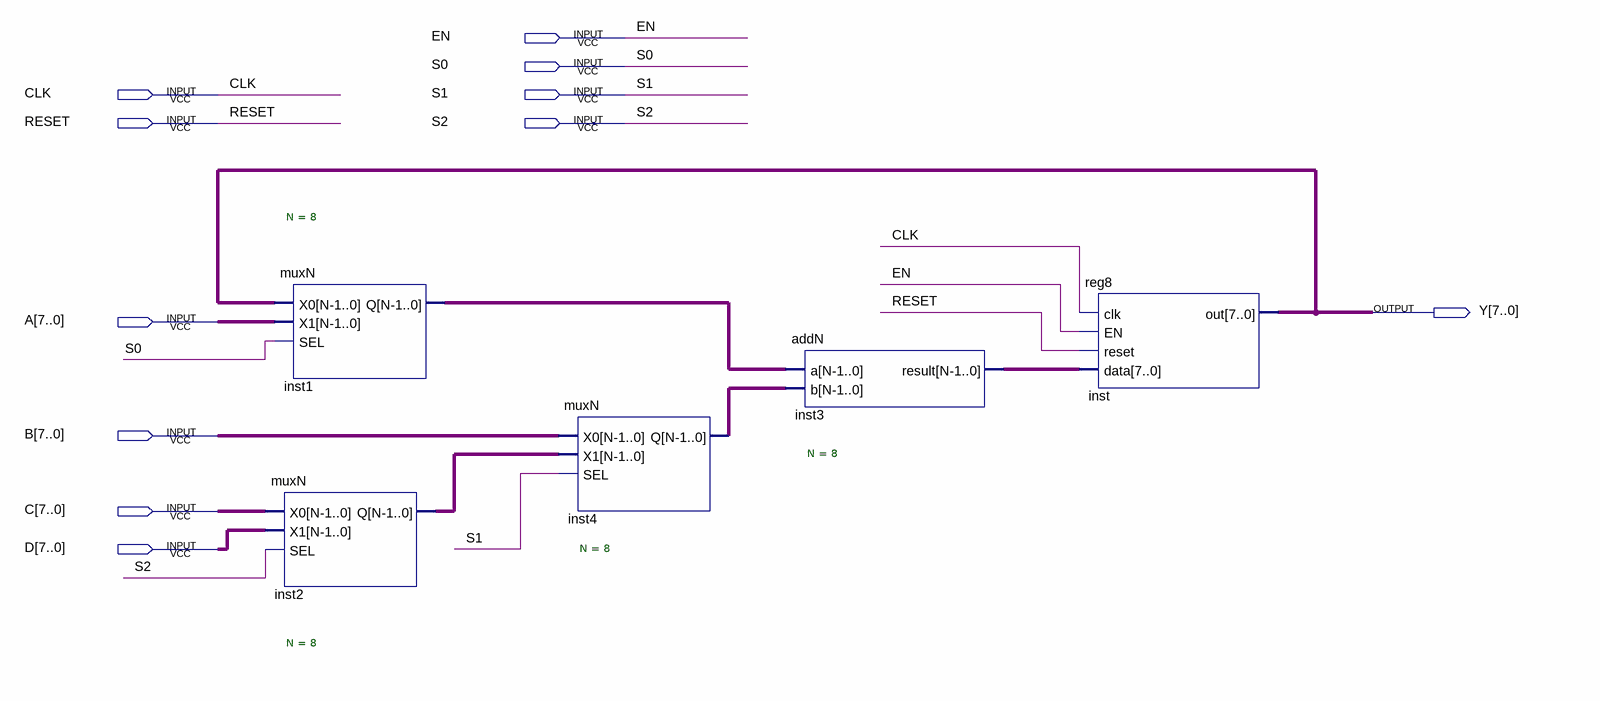
[diagram p0: schematic sheet]
// Quartus schematic add_rtl.bdf as structural Verilog: 5 symbols, 11 pins
module add_rtl (
  input  EN,
  input  S0,
  input  CLK,
  input  S1,
  input  RESET,
  input  S2,
  input  [7:0] A,
  input  [7:0] B,
  input  [7:0] C,
  input  [7:0] D,
  output [7:0] Y
);

  wire [7:0] inst1_q, inst2_q, inst3_result, inst4_q;

  muxN #(.N(8)) inst1 (.X0(Y), .X1(A), .SEL(S0), .Q(inst1_q));
  muxN #(.N(8)) inst2 (.X0(C), .X1(D), .SEL(S2), .Q(inst2_q));
  muxN #(.N(8)) inst4 (.X0(B), .X1(inst2_q), .SEL(S1), .Q(inst4_q));
  addN #(.N(8)) inst3 (.a(inst1_q), .b(inst4_q), .result(inst3_result));
  reg8 inst (.clk(CLK), .EN(EN), .reset(RESET), .data(inst3_result), .out(Y));
endmodule
